# Altium schematic sheet Top_Level.SchDoc
size A4
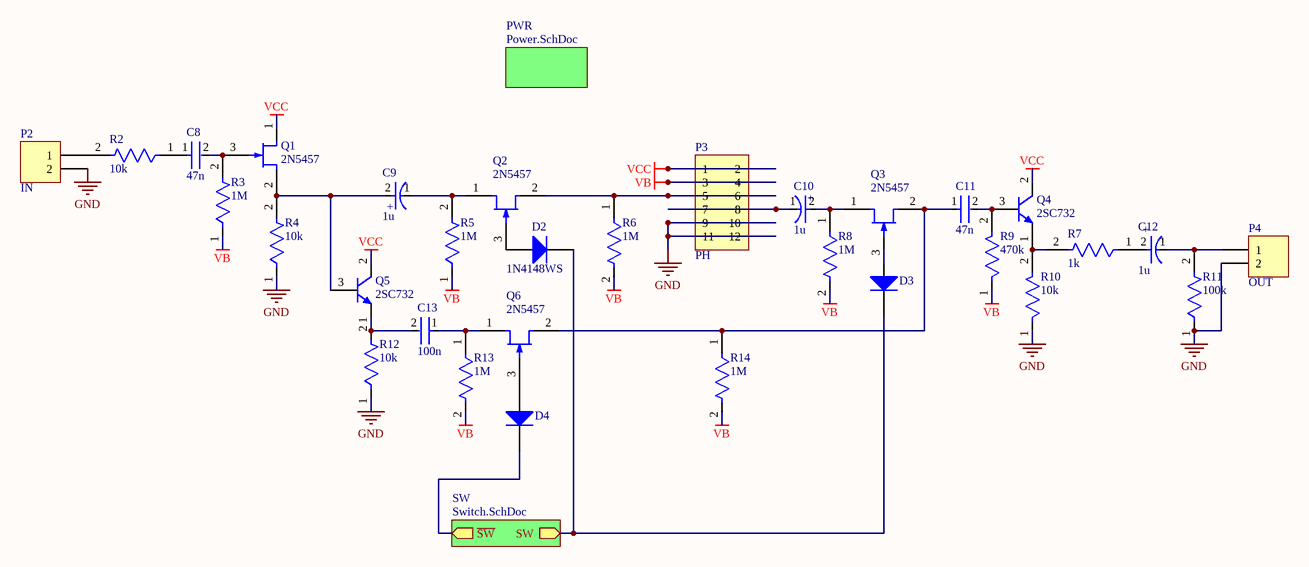
[diagram p0: Top_Level.SchDoc]

## Parts
C8  47n  [FP-CL10-IPC_A]
C9  1u  [FP-TAJA-MFG]
C10  1u  [FP-TAJA-MFG]
C11  47n  [FP-CL10-IPC_A]
C12  1u  [FP-TAJA-MFG]
C13  100n  [FP-CL10-IPC_A]
D2  1N4148WS  [DIOD-SOD323-2-A_V]
D3  1N4148WS  [DIOD-SOD323-2-A_V]  (value not drawn)
D4  1N4148WS  [DIOD-SOD323-2-A_V]  (value not drawn)
P2  IN  [HDR1X2]
P3  PH  [HDR2X6]
P4  OUT  [HDR1X2]
Q1  2N5457  [TO-92]
Q2  2N5457  [TO-92]
Q3  2N5457  [TO-92]
Q4  2SC732  [TO-92]
Q5  2SC732  [TO-92]
Q6  2N5457  [TO-92]
R2  10k  [FP-RT0805-MFG]
R3  1M  [FP-RT0805-MFG]
R4  10k  [FP-RT0805-MFG]
R5  1M  [FP-RT0805-MFG]
R6  1M  [FP-RT0805-MFG]
R7  1k  [FP-RT0805-MFG]
R8  1M  [FP-RT0805-MFG]
R9  470k  [FP-RT0805-MFG]
R10  10k  [FP-RT0805-MFG]
R11  100k  [FP-RT0805-MFG]
R12  10k  [FP-RT0805-MFG]
R13  1M  [FP-RT0805-MFG]
R14  1M  [FP-RT0805-MFG]

## Sub-sheets
PWR = Power.SchDoc: no entries
SW = Switch.SchDoc: ~{SW} (out), SW (out)

## Nets
GND: P2.2 P3.9 P3.10 P3.11 P3.12 P4.2 R4.1 R10.1 R11.1 R12.1
VB: P3.3 P3.4 R3.1 R5.1 R6.2 R8.2 R9.1 R13.2 R14.2
VCC: P3.1 P3.2 Q1.1(D) Q4.2(C) Q5.2(C)
NetC8_1: C8.1 R2.1
NetC8_2: C8.2 Q1.3(G) R3.2
NetC9_1: C9.1(C) Q2.1(D) R5.2
NetC9_2: C9.2(A) Q1.2(S) Q5.3(B) R4.2
NetC10_1: C10.1(C) P3.7 P3.8
NetC10_2: C10.2(A) Q3.1(D) R8.1
NetC11_1: C11.1 Q3.2(S) Q6.2(S) R14.1
NetC11_2: C11.2 Q4.3(B) R9.2
NetC12_1: C12.1(C) P4.1 R11.2
NetC12_2: C12.2(A) R7.1
NetC13_1: C13.1 Q6.1(D) R13.1
NetC13_2: C13.2 Q5.1(E) R12.2
NetD2_1: D2.1(A) Q2.3(G)
NetD2_2: D2.2(K) D3.2(K) ; sheet SW/SW
NetD3_1: D3.1(A) Q3.3(G)
NetD4_1: D4.1(A) Q6.3(G)
NetD4_2: D4.2(K) ; sheet SW/~{SW}
NetP2_1: P2.1 R2.2
NetP3_5: P3.5 P3.6 Q2.2(S) R6.1
NetQ4_1: Q4.1(E) R7.2 R10.2

## Notes on the sheet
- (in symbol CMP-1661-00004-2) +

## Library data of the parts
C8 C11 C13 = CMP-13271-004807-1: Cap Ceramic 1nF 50V C0G ±5% Pad SMD 0603 +125°C T/R; Temperature Coefficient: 300ppm/°C; Voltage Rating (DC): 50V; Length: 1.6mm; Width: 0.031inch; Series: CL; Case Code (Imperial): 0603; Voltage: 50V; Lead Free: Lead Free; Packaging: Tape and Reel; Dielectric: C0G; Material: Ceramic; Thickness: 0.035inch; Max Operating Temperature: 125°C; Package Quantity: 1; RoHS Compliant: Yes; Radiation Hardening: No; Capacitance: 1nF; Mount: Surface Mount; Voltage Rating: 50V; Height: 0.8mm; Tolerance: 5%; Min Operating Temperature: -55°C; Case Code (Metric): 1608; Case/Package: 0603; Depth: 0.8mm
C9 C10 C12 = CMP-1661-00004-2: 10uF 16V  ±10% 3Ω 1206  SMD Tantalum Capacitor; ESR (Equivalent Series Resistance): 3R; Leakage Current: 1.6uA; Dissipation Factor: 8%; Polarity: Polar; Length: 3.2mm; Features: General Purpose; Voltage Rating: 16V; Voltage: 16V; Mount: Surface Mount; Case/Package: 1206; Number of Pins: 2; Case Code (Metric): 3216; Radiation Hardening: No; Min Operating Temperature: -55°C; Case Code (Imperial): 1206; Height - Seated (Max): 0.071inch; Lead Free: Lead Free; Termination: SMD/SMT; Dielectric Material: Tantalum; Width: 1.6mm; Tolerance: 10%; Capacitance: 10uF; Lead Pitch: 1.1mm; Max Operating Temperature: 125°C; Voltage Rating (DC): 16V; Packaging: Tape and Reel; Package Quantity: 1; REACH SVHC: No SVHC; Depth: 1.6mm; Height: 1.6mm
D2-D4 = CMP-1667-00004-1: Fast Switching Diode, 75 V, 0.3 A, -65 to 150 degC, 2-Pin SOD323, RoHS, Tape and Reel; DatasheetVersion: Rev. 25-2, 03/2016; PackageDescription: 2-Pin Small Outline Diode, Body 1.7 x 1.3 mm; ComponentLink2Description: Datasheet; ComponentLink1URL: http://www.diodes.com/; PackageReference: SOD323-2; ComponentLink2URL: http://www.diodes.com/datasheets/ds30097.pdf; ComponentLink1Description: Manufacturer URL
P2 P4 = Header 2: Header, 2-Pin; LatestRevisionDate: 17-Jul-2002; LatestRevisionNote: Re-released for DXP Platform.; Publisher: Altium Limited
P3 = Header 6X2: Header, 6-Pin, Dual row; LatestRevisionDate: 17-Jul-2002; LatestRevisionNote: Re-released for DXP Platform.; Publisher: Altium Limited
Q1-Q3 Q6 = JFET_NPN
Q4 Q5 = BJT_NPN
R2-R14 = CMP-2001-01759-2: RES SMD 10K OHM 0.1% 1/8W 0805; Manufacturer Part Number: RT0805BRE0710KL; Manufacturer: Yageo; Voltage Rating: 150V; Resistance: 10KΩ; Tolerance: 0.0025; Temperature Coefficient: 50 ppm/°C; Power Rating: 0.125W; Value: 10KΩ; Temperature Range Low: -55°C; Device Class L2: Resistors; RoHS: TRUE; Series: RT; Device Class L1: Passive Components; Ipc Land Pattern Name: RESC200125X50; Category: Res; Automotive: No; ComponentLink2Description: Datasheet; ComponentLink2URL: http://www.yageo.com/documents/recent/PYu-RT_1-to-0.01_RoHS_L_9.pdf; Digikey Description: RES SMD 10K OHM 0.1% 1/8W 0805; Package: RT0805; Device Class L3: Chip SMD Resistors; Octopart: https://octopart.com/rt0805bre0710kl-yageo-1239246; Temperature Range High: +155°C; Lead Free: Yes; Height: 0.6mm; Composition: Thin Film; Footprint Url: http://www.yageo.com/exep/pages/download/literatures/PYu-R_Mount_10.pdf; Temperature: -55°C to +155°C; Mouser Description: Thin Film Resistors 10K ohm 0.1% 1/8W